# Altium schematic sheet BMS-S02-V02-CellMonitoring.SchDoc
size A2
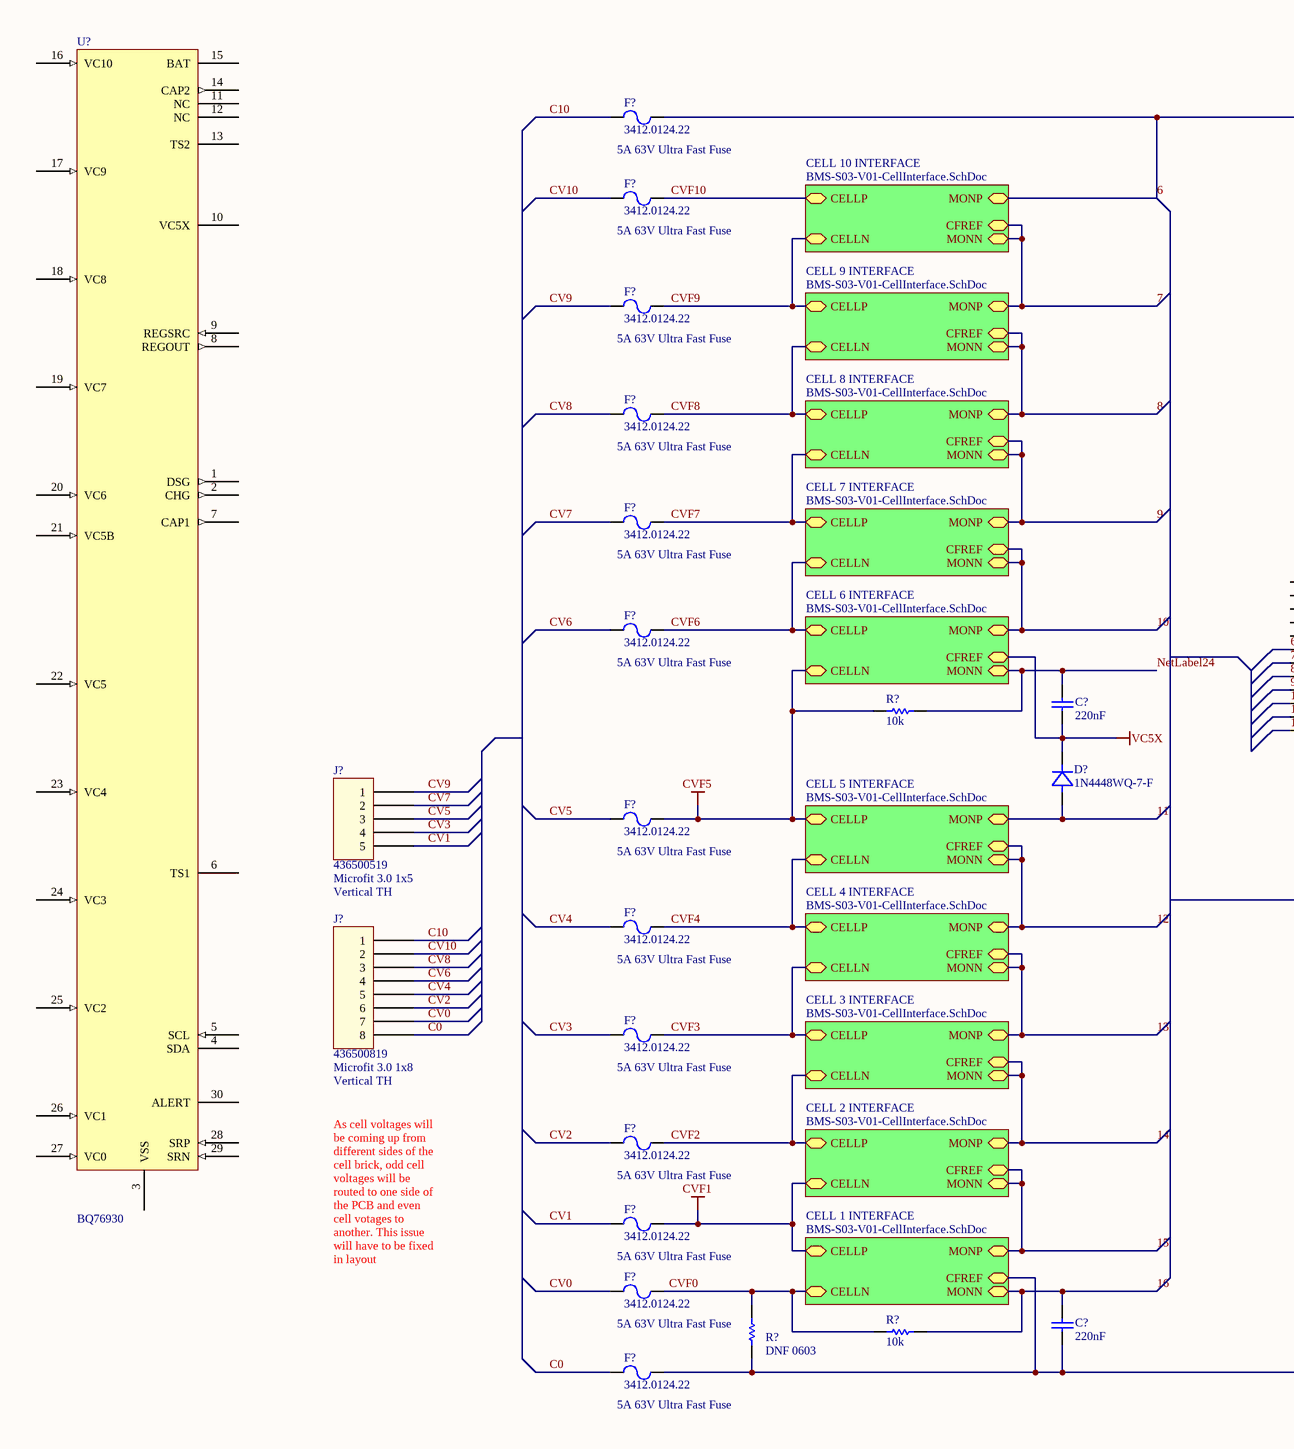
[diagram p0: BMS-S02-V02-CellMonitoring.SchDoc, left]
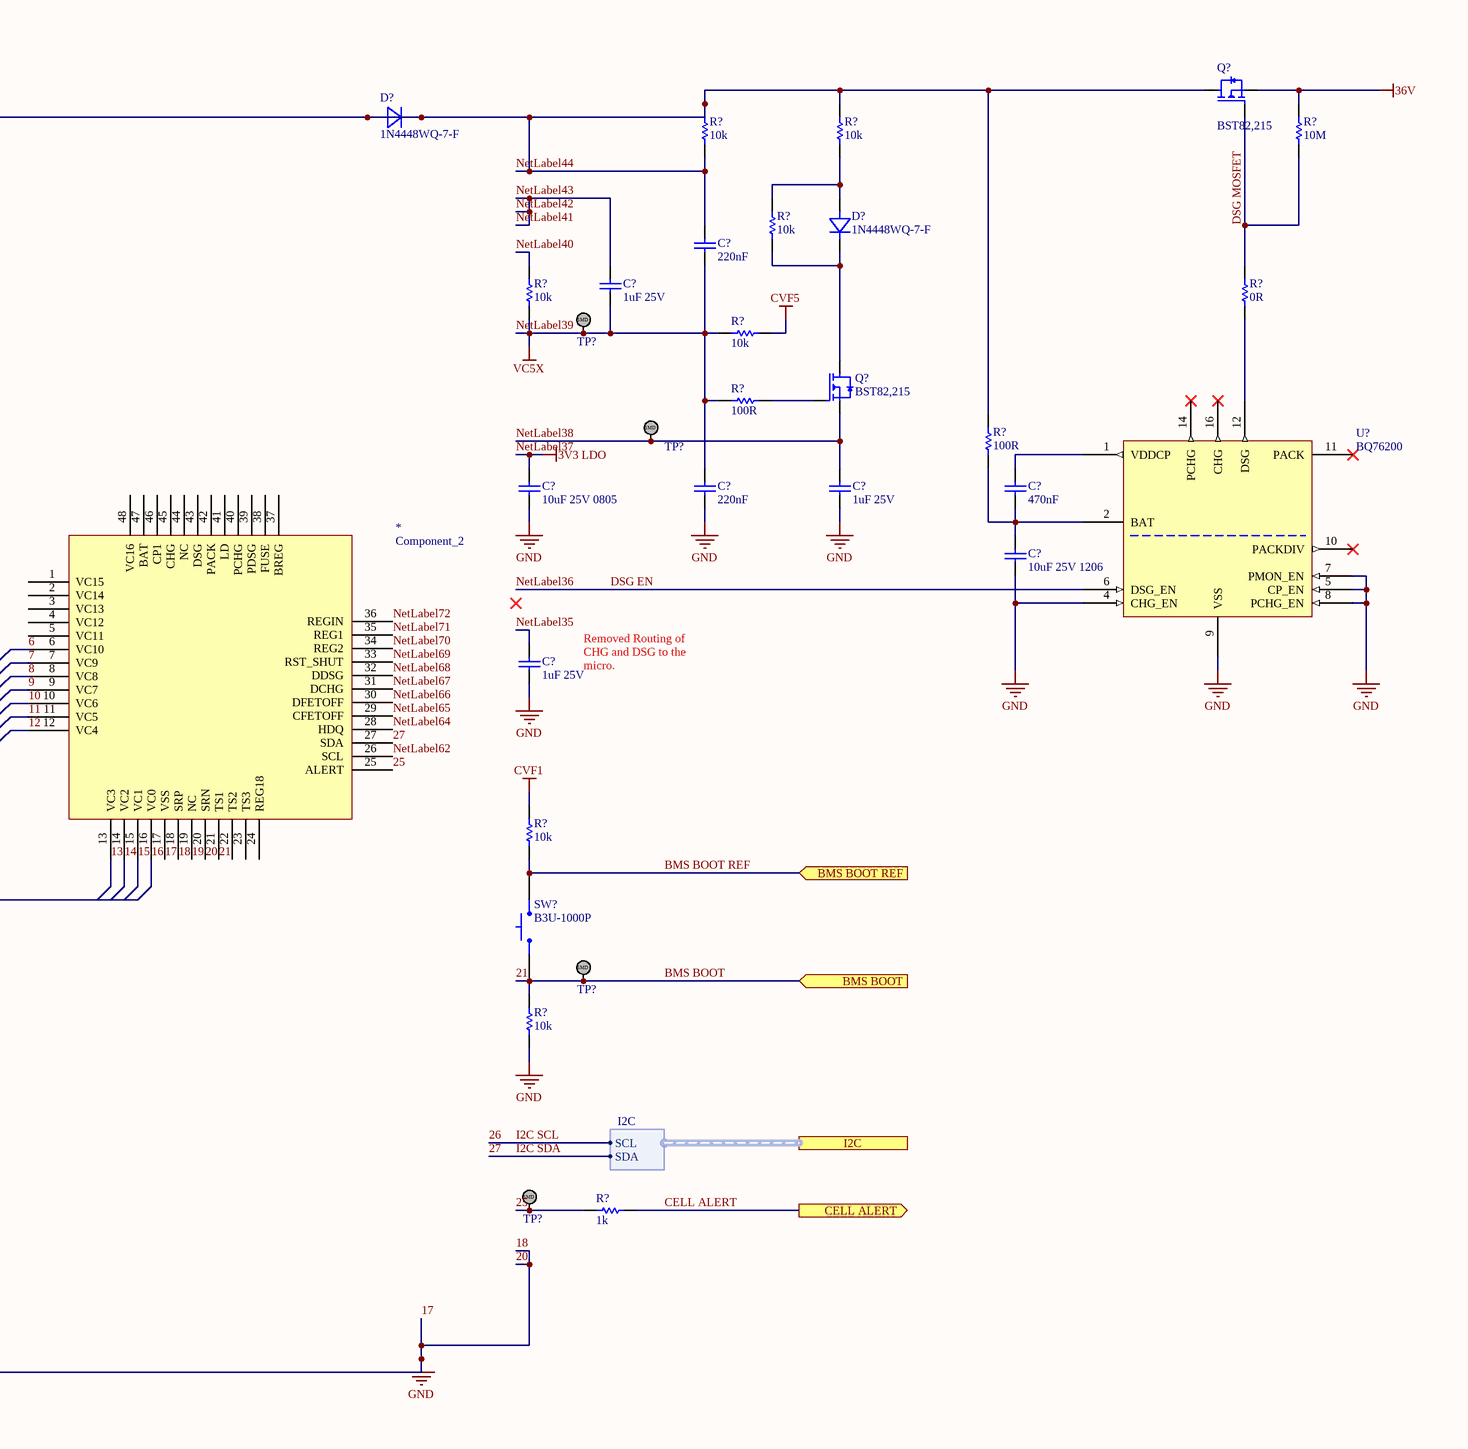
[diagram p1: BMS-S02-V02-CellMonitoring.SchDoc, right]

## Parts
(Parts that share a designator on the sheet are numbered #1, #2 ... from top to bottom, then left to right.)
*  Component_2
C?#1  220nF  [Cap_Ceramic_0603]
C?#2  1uF 25V  [Cap_Ceramic_0603]
C?#3  10uF 25V 0805  [Cap_Ceramic_0805]
C?#4  220nF  [Cap_Ceramic_0603]
C?#5  1uF 25V  [Cap_Ceramic_0603]
C?#6  470nF  [Cap_Ceramic_0603]
C?#7  10uF 25V 1206  [Cap_Ceramic_1206]
C?#8  1uF 25V  [Cap_Ceramic_0603]
C?#9  220nF  [Cap_Ceramic_0603]
C?#10  220nF  [Cap_Ceramic_0603]
D?#1  1N4448WQ-7-F  [SMA]
D?#2  1N4448WQ-7-F  [SMA]
D?#3  1N4448WQ-7-F  [SMA]
F?#1  3412.0124.22  [3412.0124.22]
F?#2  3412.0124.22  [3412.0124.22]
F?#3  3412.0124.22  [3412.0124.22]
F?#4  3412.0124.22  [3412.0124.22]
F?#5  3412.0124.22  [3412.0124.22]
F?#6  3412.0124.22  [3412.0124.22]
F?#7  3412.0124.22  [3412.0124.22]
F?#8  3412.0124.22  [3412.0124.22]
F?#9  3412.0124.22  [3412.0124.22]
F?#10  3412.0124.22  [3412.0124.22]
F?#11  3412.0124.22  [3412.0124.22]
F?#12  3412.0124.22  [3412.0124.22]
F?#13  3412.0124.22  [3412.0124.22]
J?#1  436500519  [Microfit_1X5_V_TH]
J?#2  436500819  [Microfit_1X8_V_TH]
Q?#1  BST82,215  [BST82,215]
Q?#2  BST82,215  [BST82,215]
R?#1  10k  [Res_ThinFilm_0603]
R?#2  10k  [Res_ThinFilm_0603]
R?#3  10M  [Res_ThinFilm_0603]
R?#4  10k  [Res_ThinFilm_0603]
R?#5  10k  [Res_ThinFilm_0603]
R?#6  0R  [Res_ThinFilm_0603]
R?#7  10k  [Res_ThinFilm_0603]
R?#8  100R  [Res_ThinFilm_0603]
R?#9  100R  [Res_ThinFilm_0603]
R?#10  10k  [Res_ThinFilm_0603]
R?#11  10k  [Res_ThinFilm_0603]
R?#12  10k  [Res_ThinFilm_0603]
R?#13  1k  [Res_ThinFilm_0603]
R?#14  DNF 0603  [Res_ThinFilm_0603]
R?#15  10k  [Res_ThinFilm_0603]
SW?  B3U-1000P  [BTN B3U-1000P]
TP?#1  TestPoint_SMD  [TestPointSMD]  (value not drawn)
TP?#2  TestPoint_SMD  [TestPointSMD]  (value not drawn)
TP?#3  TestPoint_SMD  [TestPointSMD]  (value not drawn)
TP?#4  TestPoint_SMD  [TestPointSMD]  (value not drawn)
U?#1  BQ76200  [BQ76200]
U?#2  BQ76930  [bq76930]

## Sub-sheets
CELL 1 INTERFACE = BMS-S03-V01-CellInterface.SchDoc: CFREF (bidir), MONP (bidir), MONN (bidir), CELLP (bidir), CELLN (bidir)
CELL 2 INTERFACE = BMS-S03-V01-CellInterface.SchDoc: CFREF (bidir), MONP (bidir), MONN (bidir), CELLP (bidir), CELLN (bidir)
CELL 3 INTERFACE = BMS-S03-V01-CellInterface.SchDoc: CFREF (bidir), MONP (bidir), MONN (bidir), CELLP (bidir), CELLN (bidir)
CELL 4 INTERFACE = BMS-S03-V01-CellInterface.SchDoc: CFREF (bidir), MONP (bidir), MONN (bidir), CELLP (bidir), CELLN (bidir)
CELL 5 INTERFACE = BMS-S03-V01-CellInterface.SchDoc: CFREF (bidir), MONP (bidir), MONN (bidir), CELLP (bidir), CELLN (bidir)
CELL 6 INTERFACE = BMS-S03-V01-CellInterface.SchDoc: CFREF (bidir), MONP (bidir), MONN (bidir), CELLP (bidir), CELLN (bidir)
CELL 7 INTERFACE = BMS-S03-V01-CellInterface.SchDoc: CFREF (bidir), MONP (bidir), MONN (bidir), CELLP (bidir), CELLN (bidir)
CELL 8 INTERFACE = BMS-S03-V01-CellInterface.SchDoc: CFREF (bidir), MONP (bidir), MONN (bidir), CELLP (bidir), CELLN (bidir)
CELL 9 INTERFACE = BMS-S03-V01-CellInterface.SchDoc: CFREF (bidir), MONP (bidir), MONN (bidir), CELLP (bidir), CELLN (bidir)
CELL 10 INTERFACE = BMS-S03-V01-CellInterface.SchDoc: CFREF (bidir), MONP (bidir), MONN (bidir), CELLP (bidir), CELLN (bidir)

## Ports
BMS BOOT (in), BMS BOOT REF (in), CELL ALERT (out), I2C (harness I2C)

## Harnesses
I2C: SDA, SCL

## Nets
17: *.17(VSS) *.18(SRP) *.20(SRN) C?#3.1 C?#4.1 C?#5.1 C?#7.1 C?#8.1 C?#10.1 F?#13.2 R?#12.1 R?#14.1 U?#1.4(CHG_EN) U?#1.5(CP_EN) U?#1.7(PMON_EN) U?#1.8(PCHG_EN) U?#1.9(VSS) ; sheet CELL 1 INTERFACE/CFREF  [also labelled 18, 20, GND]
36V: Q?#1.S(Source) R?#3.2
CVF1: F?#11.2 R?#11.2 ; sheet CELL 1 INTERFACE/CELLP, sheet CELL 2 INTERFACE/CELLN
CVF5: F?#7.2 R?#7.2 R?#10.1 ; sheet CELL 5 INTERFACE/CELLP, sheet CELL 6 INTERFACE/CELLN
NetLabel37: C?#3.2  [also labelled 3V3 LDO]
NetLabel39: C?#1.1 C?#2.1 C?#4.2 C?#9.1 D?#3.K(Cathode) R?#5.1 R?#7.1 R?#8.2 TP?#1.1 ; sheet CELL 6 INTERFACE/CFREF  [also labelled VC5X]
6: *.6(VC10) C?#1.2 D?#1.A(Anode) D?#1.K(Cathode) F?#1.2 Q?#1.D(Drain) R?#1.1 R?#1.2 R?#2.2 R?#9.2 ; sheet CELL 10 INTERFACE/MONP  [also labelled NetLabel44]
7: *.7(VC9) ; sheet CELL 10 INTERFACE/CFREF, sheet CELL 10 INTERFACE/MONN, sheet CELL 9 INTERFACE/MONP
8: *.8(VC8) ; sheet CELL 8 INTERFACE/MONP, sheet CELL 9 INTERFACE/CFREF, sheet CELL 9 INTERFACE/MONN
9: *.9(VC7) ; sheet CELL 7 INTERFACE/MONP, sheet CELL 8 INTERFACE/CFREF, sheet CELL 8 INTERFACE/MONN
10: *.10(VC6) ; sheet CELL 6 INTERFACE/MONP, sheet CELL 7 INTERFACE/CFREF, sheet CELL 7 INTERFACE/MONN
11: *.11(VC5) D?#3.A(Anode) ; sheet CELL 5 INTERFACE/MONP
12: *.12(VC4) ; sheet CELL 4 INTERFACE/MONP, sheet CELL 5 INTERFACE/CFREF, sheet CELL 5 INTERFACE/MONN
13: *.13(VC3) ; sheet CELL 3 INTERFACE/MONP, sheet CELL 4 INTERFACE/CFREF, sheet CELL 4 INTERFACE/MONN
14: *.14(VC2) ; sheet CELL 2 INTERFACE/MONP, sheet CELL 3 INTERFACE/CFREF, sheet CELL 3 INTERFACE/MONN
15: *.15(VC1) ; sheet CELL 1 INTERFACE/MONP, sheet CELL 2 INTERFACE/CFREF, sheet CELL 2 INTERFACE/MONN
16: *.16(VC0) C?#10.2 R?#15.2 ; sheet CELL 1 INTERFACE/MONN
19: *.19(NC)
21: *.21(TS1) R?#12.2 SW?.1 TP?#3.1 ; port BMS BOOT  [also labelled BMS BOOT]
25: *.25(ALERT) R?#13.1 TP?#4.1
26: port I2C.SCL  [also labelled I2C SCL]
27: *.27(SDA) ; port I2C.SDA  [also labelled I2C SDA]
BMS BOOT REF: R?#11.1 SW?.2 ; port BMS BOOT REF
C0: F?#13.1 J?#2.8
C10: F?#1.1 J?#2.1
CELL ALERT: R?#13.2 ; port CELL ALERT
CV0: F?#12.1 J?#2.7
CV1: F?#11.1 J?#1.5
CV2: F?#10.1 J?#2.6
CV3: F?#9.1 J?#1.4
CV4: F?#8.1 J?#2.5
CV5: F?#7.1 J?#1.3
CV6: F?#6.1 J?#2.4
CV7: F?#5.1 J?#1.2
CV8: F?#4.1 J?#2.3
CV9: F?#3.1 J?#1.1
CV10: F?#2.1 J?#2.2
CVF0: F?#12.2 R?#14.2 R?#15.1 ; sheet CELL 1 INTERFACE/CELLN
CVF2: F?#10.2 ; sheet CELL 2 INTERFACE/CELLP, sheet CELL 3 INTERFACE/CELLN
CVF3: F?#9.2 ; sheet CELL 3 INTERFACE/CELLP, sheet CELL 4 INTERFACE/CELLN
CVF4: F?#8.2 ; sheet CELL 4 INTERFACE/CELLP, sheet CELL 5 INTERFACE/CELLN
CVF6: F?#6.2 ; sheet CELL 6 INTERFACE/CELLP, sheet CELL 7 INTERFACE/CELLN
CVF7: F?#5.2 ; sheet CELL 7 INTERFACE/CELLP, sheet CELL 8 INTERFACE/CELLN
CVF8: F?#4.2 ; sheet CELL 8 INTERFACE/CELLP, sheet CELL 9 INTERFACE/CELLN
CVF9: F?#3.2 ; sheet CELL 10 INTERFACE/CELLN, sheet CELL 9 INTERFACE/CELLP
CVF10: F?#2.2 ; sheet CELL 10 INTERFACE/CELLP
DSG EN: U?#1.6(DSG_EN)  [also labelled NetLabel36]
DSG MOSFET: Q?#1.G(Gate) R?#3.1 R?#6.2
NetLabel24: C?#9.2 R?#10.2 ; sheet CELL 6 INTERFACE/MONN
NetLabel35: C?#8.2
NetLabel38: C?#5.2 Q?#2.S(Source) TP?#2.1
NetLabel40: R?#5.2
NetLabel41: C?#2.2  [also labelled NetLabel42, NetLabel43]
NetLabel62: *.26(SCL)
NetLabel64: *.28(HDQ)
NetLabel65: *.29(CFETOFF)
NetLabel66: *.30(DFETOFF)
NetLabel67: *.31(DCHG)
NetLabel68: *.32(DDSG)
NetLabel69: *.33(RST_SHUT)
NetLabel70: *.34(REG2)
NetLabel71: *.35(REG1)
NetLabel72: *.36(REGIN)
NetC?#6_1: C?#6.1 C?#7.2 R?#9.1 U?#1.2(BAT)
NetC?#6_2: C?#6.2 U?#1.1(VDDCP)
NetD?#2_A: D?#2.A(Anode) R?#2.1 R?#4.2
NetD?#2_K: D?#2.K(Cathode) Q?#2.D(Drain) R?#4.1
NetQ?#2_G: Q?#2.G(Gate) R?#8.1
NetR?#6_1: R?#6.1 U?#1.12(DSG)

Not connected (* = marked no-connect by the designer): * 1(VC15) 2(VC14) 3(VC13) 4(VC12) 5(VC11) 22(TS2) 23(TS3) 24(REG18) 37(BREG) 38(FUSE) 39(PDSG) 40(PCHG) 41(LD) 42(PACK) 43(DSG) 44(NC) 45(CHG) 46(CP1) 47(BAT) 48(VC16); U?#1 10(PACKDIV)* 11(PACK)* 14(PCHG)* 16(CHG)*; U?#2 1(DSG) 2(CHG) 3(VSS) 4(SDA) 5(SCL) 6(TS1) 7(CAP1) 8(REGOUT) 9(REGSRC) 10(VC5X) 11(NC) 12(NC) 13(TS2) 14(CAP2) 15(BAT) 16(VC10) 17(VC9) 18(VC8) 19(VC7) 20(VC6) 21(VC5B) 22(VC5) 23(VC4) 24(VC3) 25(VC2) 26(VC1) 27(VC0) 28(SRP) 29(SRN) 30(ALERT)

## Notes on the sheet
- (near F?#1) 5A 63V Ultra Fast Fuse
- (near F?#2) 5A 63V Ultra Fast Fuse
- (near F?#3) 5A 63V Ultra Fast Fuse
- (near F?#4) 5A 63V Ultra Fast Fuse
- (near F?#5) 5A 63V Ultra Fast Fuse
- (near F?#6) 5A 63V Ultra Fast Fuse
- Removed Routing of CHG and DSG to the micro.
- (near J?#1) Microfit 3.0 1x5
- (near J?#1) Vertical TH
- (near F?#7) 5A 63V Ultra Fast Fuse
- (near F?#8) 5A 63V Ultra Fast Fuse
- (near J?#2) Microfit 3.0 1x8
- (near J?#2) Vertical TH
- (near F?#9) 5A 63V Ultra Fast Fuse
- (near F?#10) 5A 63V Ultra Fast Fuse
- As cell voltages will be coming up from different sides of the cell brick, odd cell voltages will be routed to one side of the PCB and even cell votages to another. This issue will have to be fixed in layout
- (near F?#11) 5A 63V Ultra Fast Fuse
- (near R?#14) 5A 63V Ultra Fast Fuse
- (near F?#13) 5A 63V Ultra Fast Fuse
- (in symbol TestPoint_SMD) SMD

## Library data of the parts
C?#1 C?#4 C?#9 C?#10 = 220nF 50V 5% X7R 0603: Capacitor, Ceramic, SMD, 220nF, 50V, 5%, X7R, 0603
C?#2 C?#5 C?#8 = 1uF 25V 5% X7R 0603: Capacitor, Ceramic, SMD, 1uF, 25V, 5%, X7R, 0603
C?#3 = 10uF 25V 5% X7R 0805_1: Capacitor, Ceramic, SMD, 10uF, 25V, 5%, X7R, 0805
C?#6 = 470nF 50V 5% X7R 0603: Capacitor, Ceramic, SMD, 470nF, 50V, 5%, X7R, 0603
C?#7 = 10uF 25V 10% X7R 1206: Capacitor, Ceramic, SMD, 10uF, 25V, 10%, X7R, 1206
D?#1-D?#3 = 1N4448WQ-7-F: Diode, SMD, 75V, 5%, 250mA, SOD123; Manufacturer: ON Semiconductor / Fairchild; Manufacturer Part Number: 1N914BWS; Average Rectified Current: 150mA; Element Configuration: Single; Forward Voltage: 1V; Max Reverse Leakage Current: 5uA; Power Dissipation: 200mW; Recovery Time: 4ns; Max Forward Surge Current (Ifsm): 4A; Parameter 1: *; Weight: 0.0276g; Category: Rectifier Diodes; Contact Plating: Tin,Matte; Forward Current: 150mA; Lead Free: Lead Free; Max Operating Temperature: 150°C; Max Repetitive Reverse Voltage (Vrrm): 75V; Max Reverse Voltage (DC): 75V; Min Operating Temperature: -55°C; Mount: Surface Mount; Number of Pins: 2; Package Quantity: 1; Packaging: Tape and Reel; Peak Reverse Current: 5uA; Radiation Hardening: No; REACH SVHC: No SVHC; Reverse Recovery Time: 4ns; Height: 1mm; Length: 1.8mm; Reverse Voltage: 75V; Width: 1.35mm
F?#1-F?#13 = 3412.0124.22: FUSE BOARD MOUNT 5A 63VDC 0603
J?#1 = Microfit_1x5
J?#2 = Microfit_1x8
Q?#1 Q?#2 = BST82,215: MOSFET N-CH, 20V, SOT23
R?#1 R?#2 R?#4 R?#5 R?#7 R?#10-R?#12 R?#15 = 10k 5% 0603: Resistor, SMD, 10k, 0.1W, 5%, 0603
R?#3 = 10M 5% 0603: Resistor, SMD, 10M, 0.1W, 5%, 0603
R?#6 = 0R 5% 0603: Resistor, SMD, 0R, 0.1W, 5%, 0603
R?#8 R?#9 = 100R 5%, 0603: Resistor, SMD, 100R, 0.1W, 5%, 0603
R?#13 = 1k 5% 0603: Resistor, SMD, 1k, 0.1W, 5%, 0603
R?#14 = DNF 0603: Resistor, SMD, DNF, 0.1W, 0603
SW? = BTN B3U-1000P: Omron B3U-1000P Ultra Miniture Switch; ComponentLink1Description: LCSC; ComponentLink1URL: https://lcsc.com/product-detail/Tactile-Switches_BRIGHT-TSA063G50-250_C294565.html
U?#1 = BQ76200PWR: High-voltage battery pack front-end charge/discharge high-side NFET driver; Manufacturer: Texas Instruments; MPN: BQ76200PWR
U?#2 = BQ76930: Battery Monitoring/Fuel Gauge Li-Ion/Li-Polymer/LiFePO4 0V to 16V 30-Pin TSSOP T/R; InternalPart: Test1234; Manufacturer: Texas Instruments; Manufacturer Part Number: BQ7693003DBTR; Operating Supply Voltage: 25V; Interface: I2C; Fault Protection: Over Current,Short Circuit,Over/Under Voltage; Supplier 1: Digi-Key; RoHS: Yes; Category: Battery Management; Stock 1: 4521; Pricing 1: 1=4.66000, 10=4.18900, 25=3.96000, 100=3.25600, 250=2.92160, 500=2.81600, 1000=2.34080 (USD); Mount: Surface Mount; Case/Package: TFSOP; Number of Pins: 30; Weight: 0.003439oz; Contact Plating: Gold; Min Operating Temperature: -40°C; Max Operating Temperature: 85°C; Output Voltage: 16V; Packaging: Tape and Reel; Package Quantity: 2000; Lead Free: Lead Free; ComponentLink1URL: http://www.ti.com/lit/gpn/bq76930?src-supplier=Mouser; ComponentLink1Description: http://www.ti.com/lit/gpn/bq76930?src-supplier=Mouser; ComponentLink2URL: http://www.ti.com/lit/ds/symlink/bq76930.pdf?src-supplier=Digi-Key; ComponentLink2Description: http://www.ti.com/lit/ds/symlink/bq76930.pdf?src-supplier=Digi-Key; ComponentLink3URL: http://www.ti.com/lit/pdf/slpt038?src-supplier=Digi-Key; ComponentLink3Description: http://www.ti.com/lit/pdf/slpt038?src-supplier=Digi-Key; ComponentLink4URL: http://www.ti.com/general/docs/lit/getliterature.tsp?genericPartNumber=BQ76920&amp;&amp;fileType=pdf&src-supplier=Avnet+Asia; ComponentLink4Description: http://www.ti.com/general/docs/lit/getliterature.tsp?genericPartNumber=BQ76920&amp;&amp;fileType=pdf&src-supplier=Avnet+Asia; ComponentLink5URL: http://www.ti.com/general/docs/lit/getliterature.tsp?genericPartNumber=BQ76920&&fileType=pdf&src-supplier=Avnet; ComponentLink5Description: http://www.ti.com/general/docs/lit/getliterature.tsp?genericPartNumber=BQ76920&&fileType=pdf&src-supplier=Avnet; Supplier Part Number 1: 296-39961-1-ND